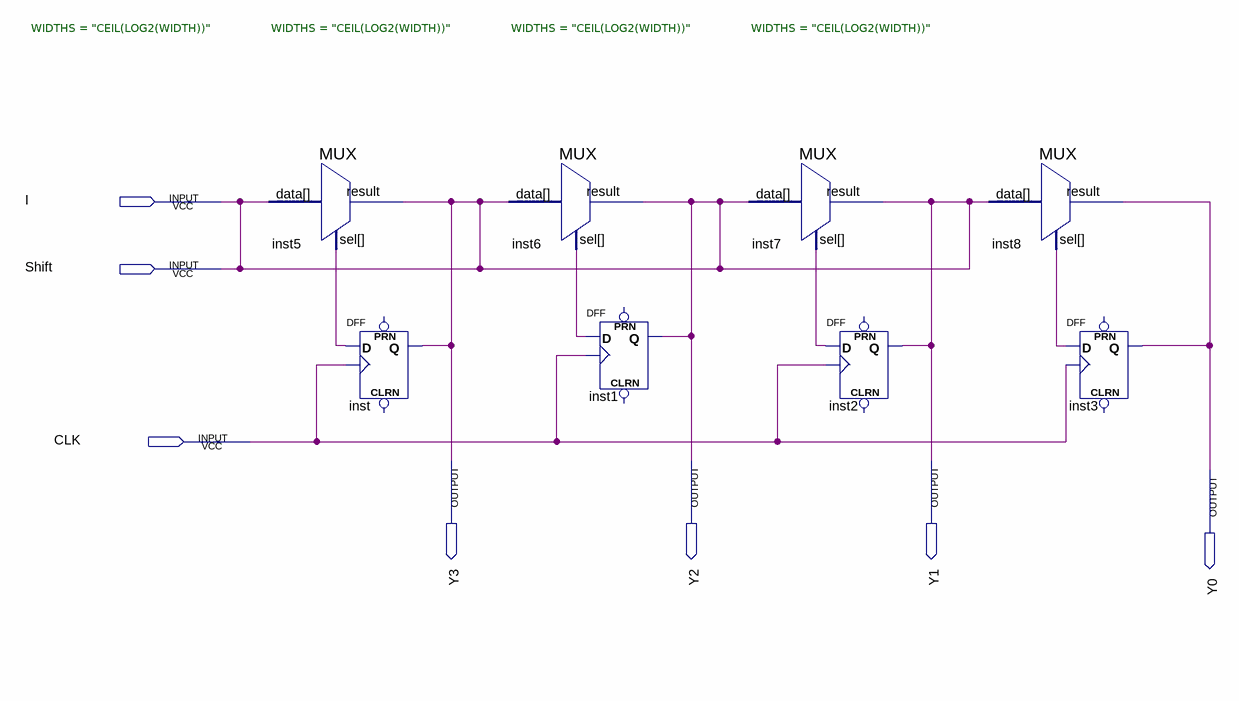
[diagram p0: schematic sheet]
// Quartus schematic shift_right.bdf as structural Verilog: 8 symbols, 7 pins
module shift_right (
  input  I,
  input  Shift,
  input  CLK,
  output Y3,
  output Y2,
  output Y1,
  output Y0
);

  wire undriven, undriven_2, undriven_3, undriven_4;

  MUX #(.WIDTHS("CEIL(LOG2(WIDTH))")) inst5 (.data(I), .sel(undriven), .result(I));
  DFF inst (.CLK(CLK), .D(undriven), .Q(I));  // open: CLRN, PRN
  MUX #(.WIDTHS("CEIL(LOG2(WIDTH))")) inst6 (.data(I), .sel(undriven_3), .result(I));
  DFF inst1 (.CLK(CLK), .D(undriven_3), .Q(I));  // open: CLRN, PRN
  MUX #(.WIDTHS("CEIL(LOG2(WIDTH))")) inst7 (.data(I), .sel(undriven_2), .result(I));
  DFF inst2 (.CLK(CLK), .D(undriven_2), .Q(I));  // open: CLRN, PRN
  MUX #(.WIDTHS("CEIL(LOG2(WIDTH))")) inst8 (.data(I), .sel(undriven_4), .result(Y0));
  DFF inst3 (.CLK(CLK), .D(undriven_4), .Q(Y0));  // open: CLRN, PRN

  assign Shift = I;
  assign Y1 = I;
  assign Y2 = I;
  assign Y3 = I;
endmodule
